# EAGLE schematic MiniPrinterController (EAGLE 9.6.2)

## Sheet 1 of 2: power board
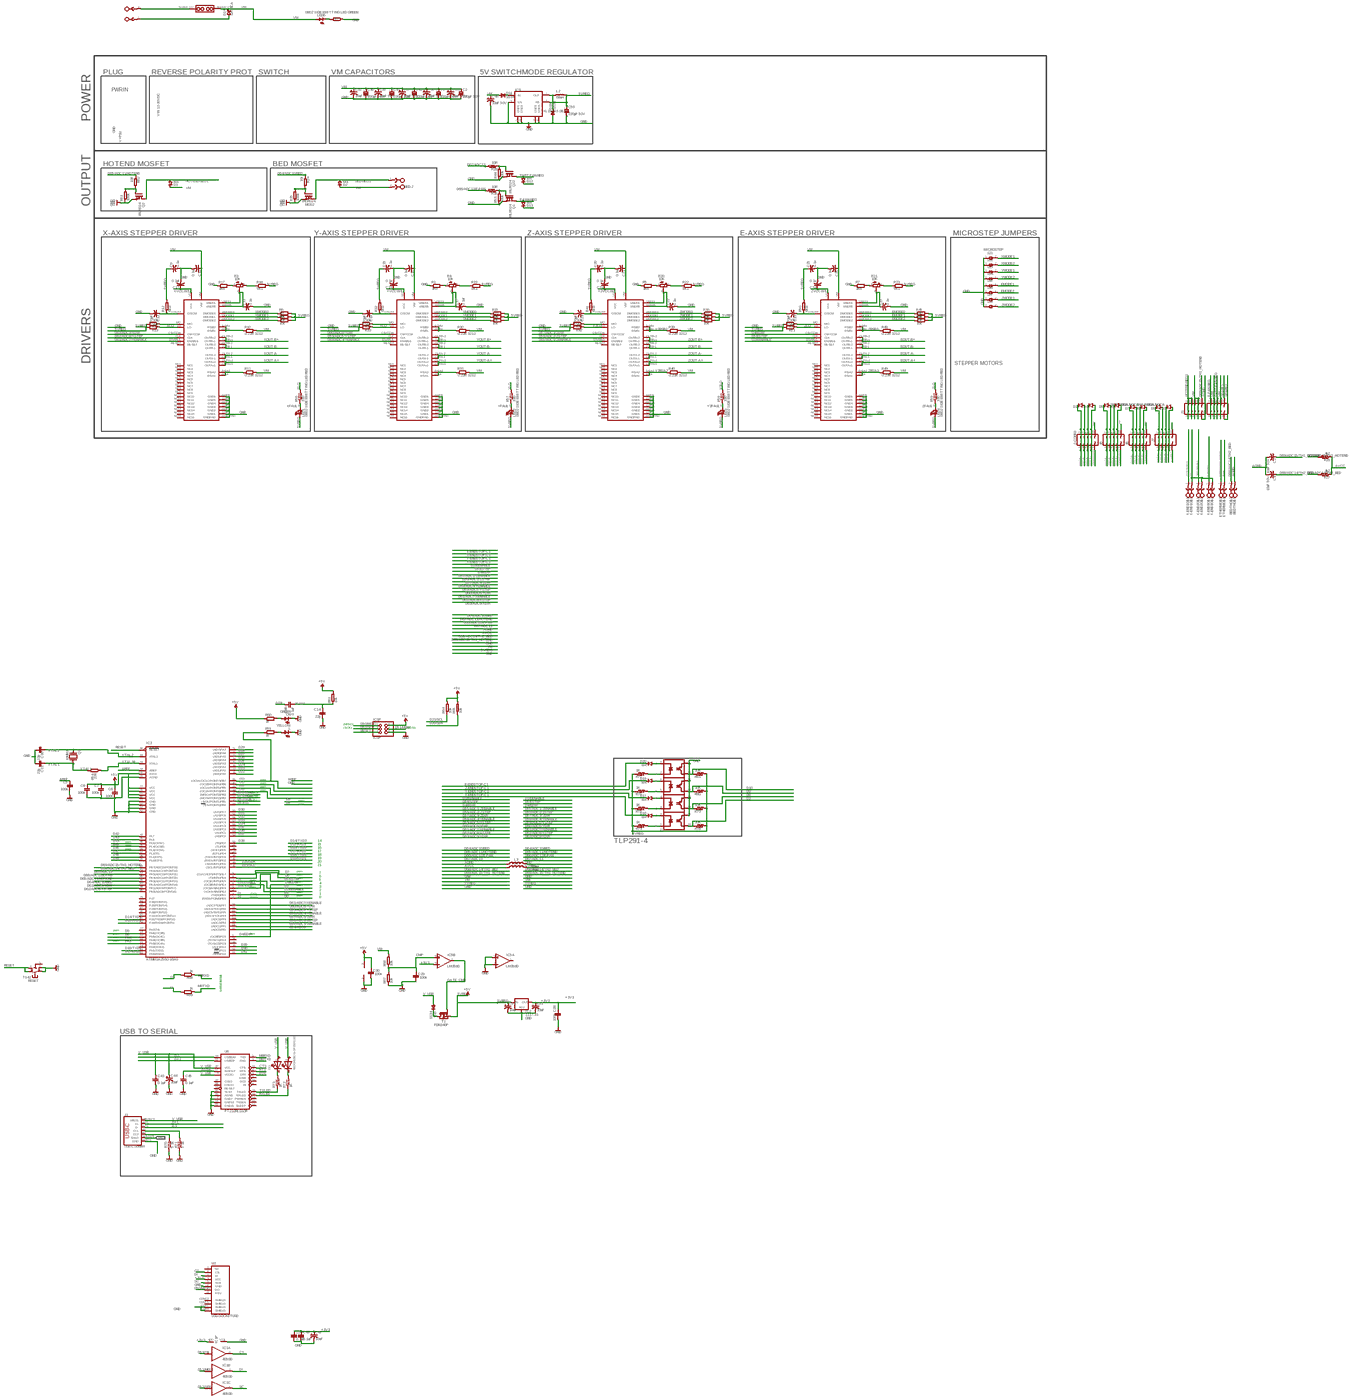
[diagram p0: schematic, sheet 1, overview]
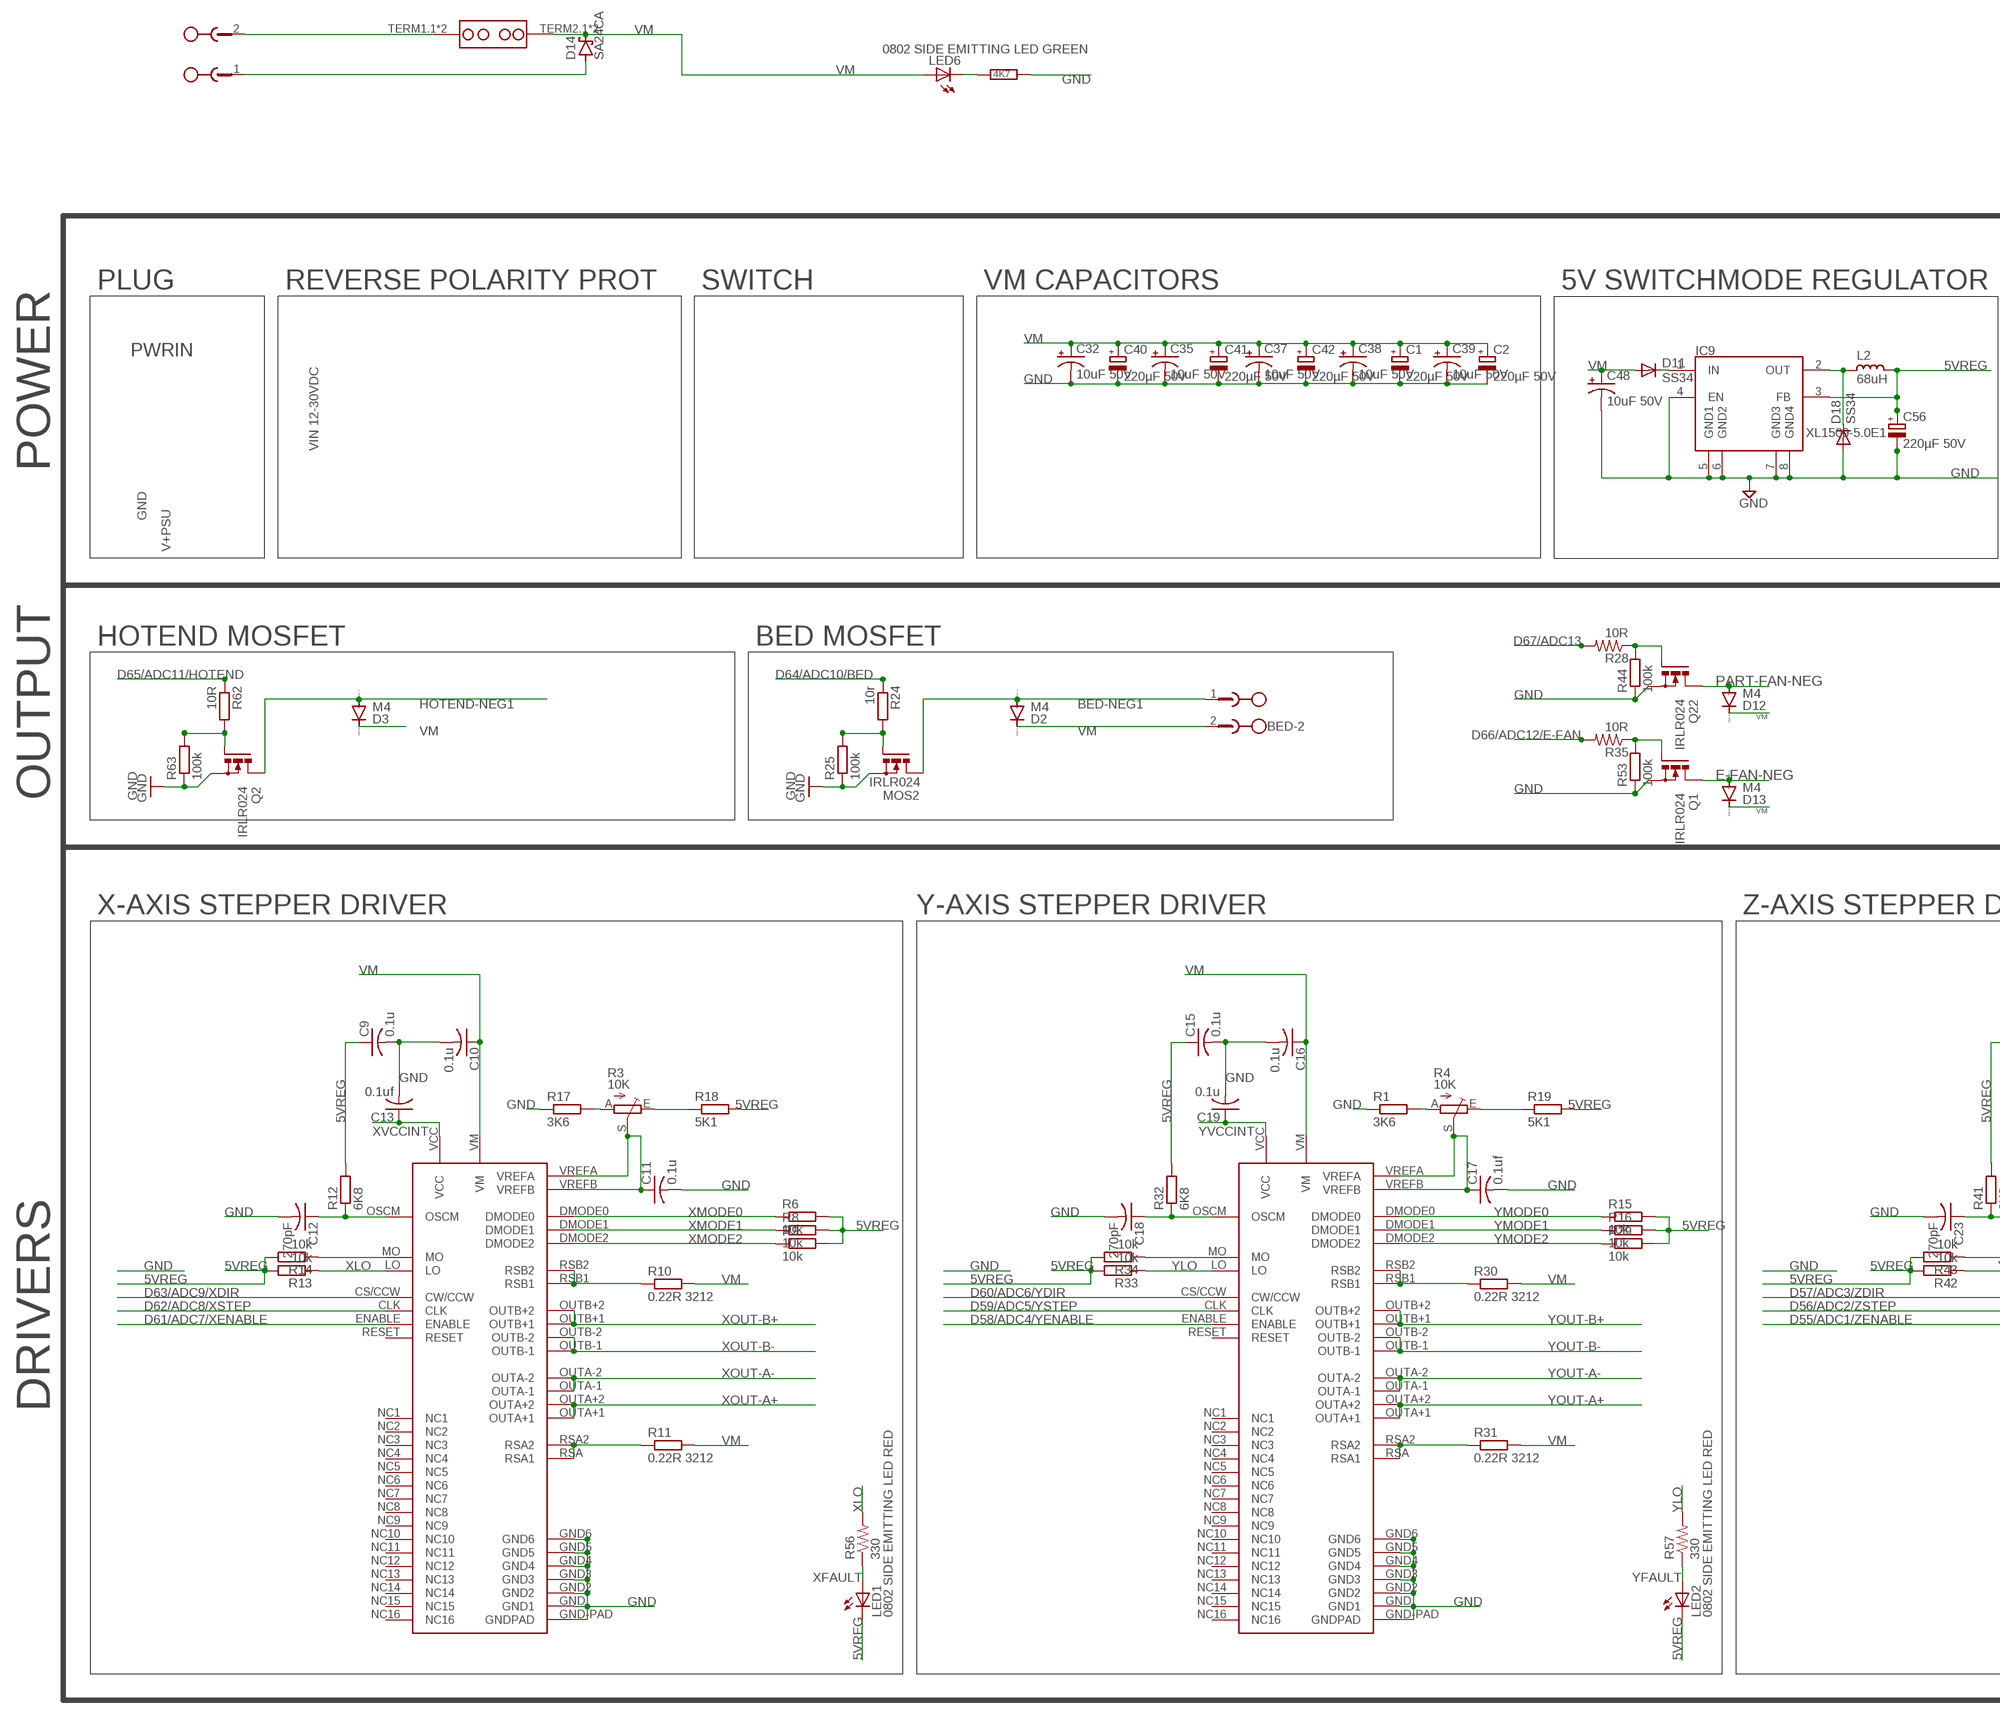
[diagram p1: schematic, sheet 1, part 1 of 7]
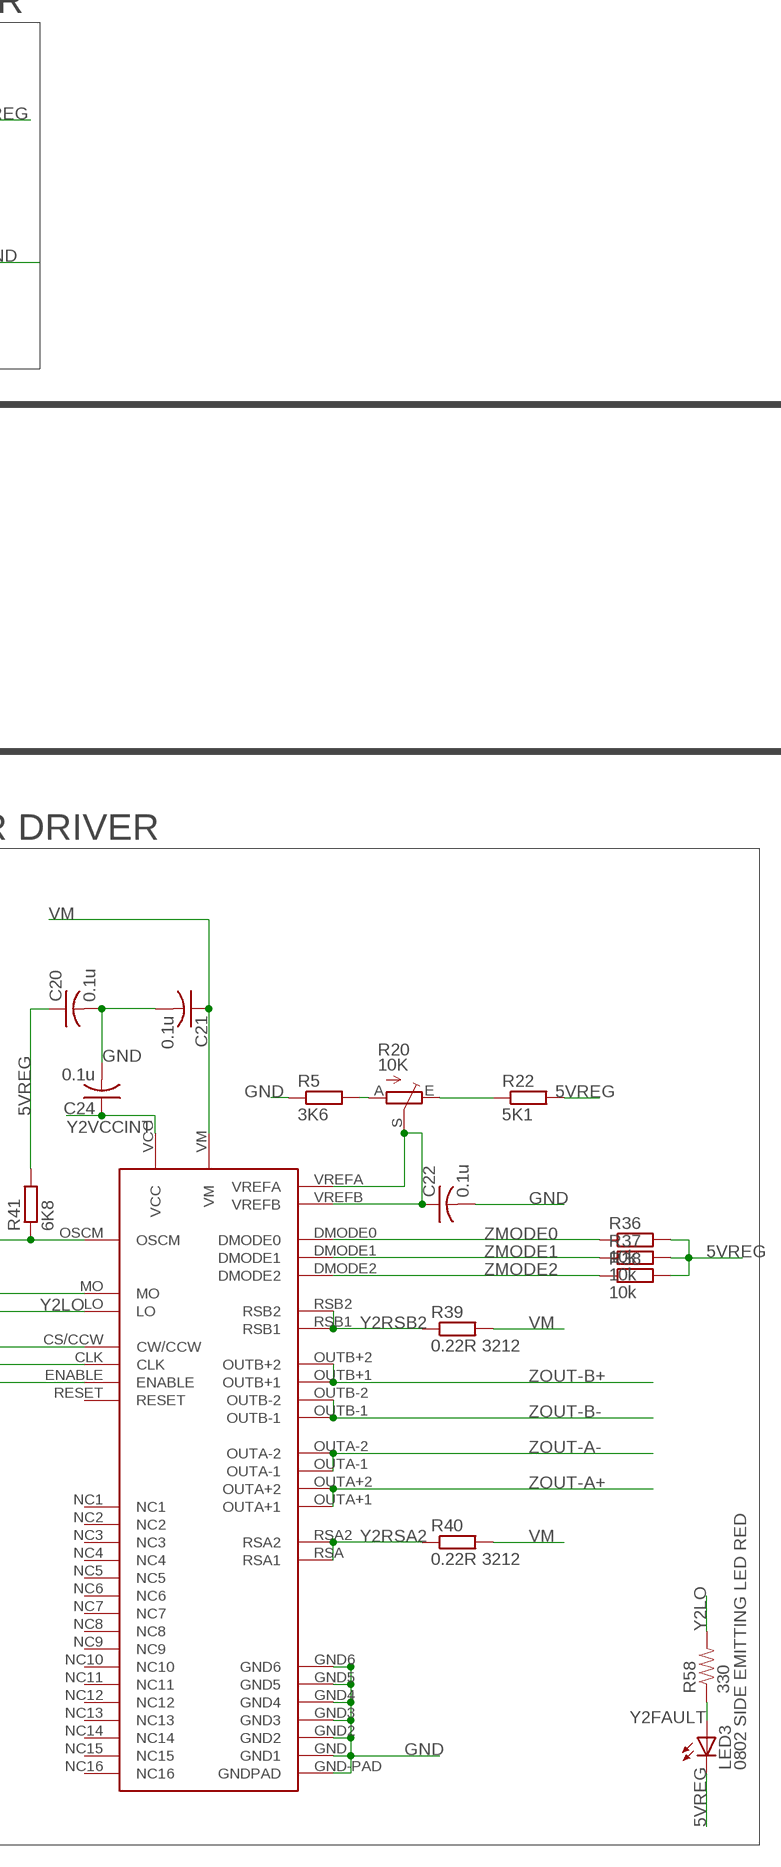
[diagram p2: schematic, sheet 1, part 2 of 7]
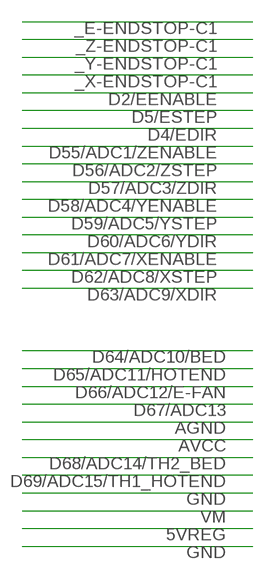
[diagram p3: schematic, sheet 1, part 3 of 7]
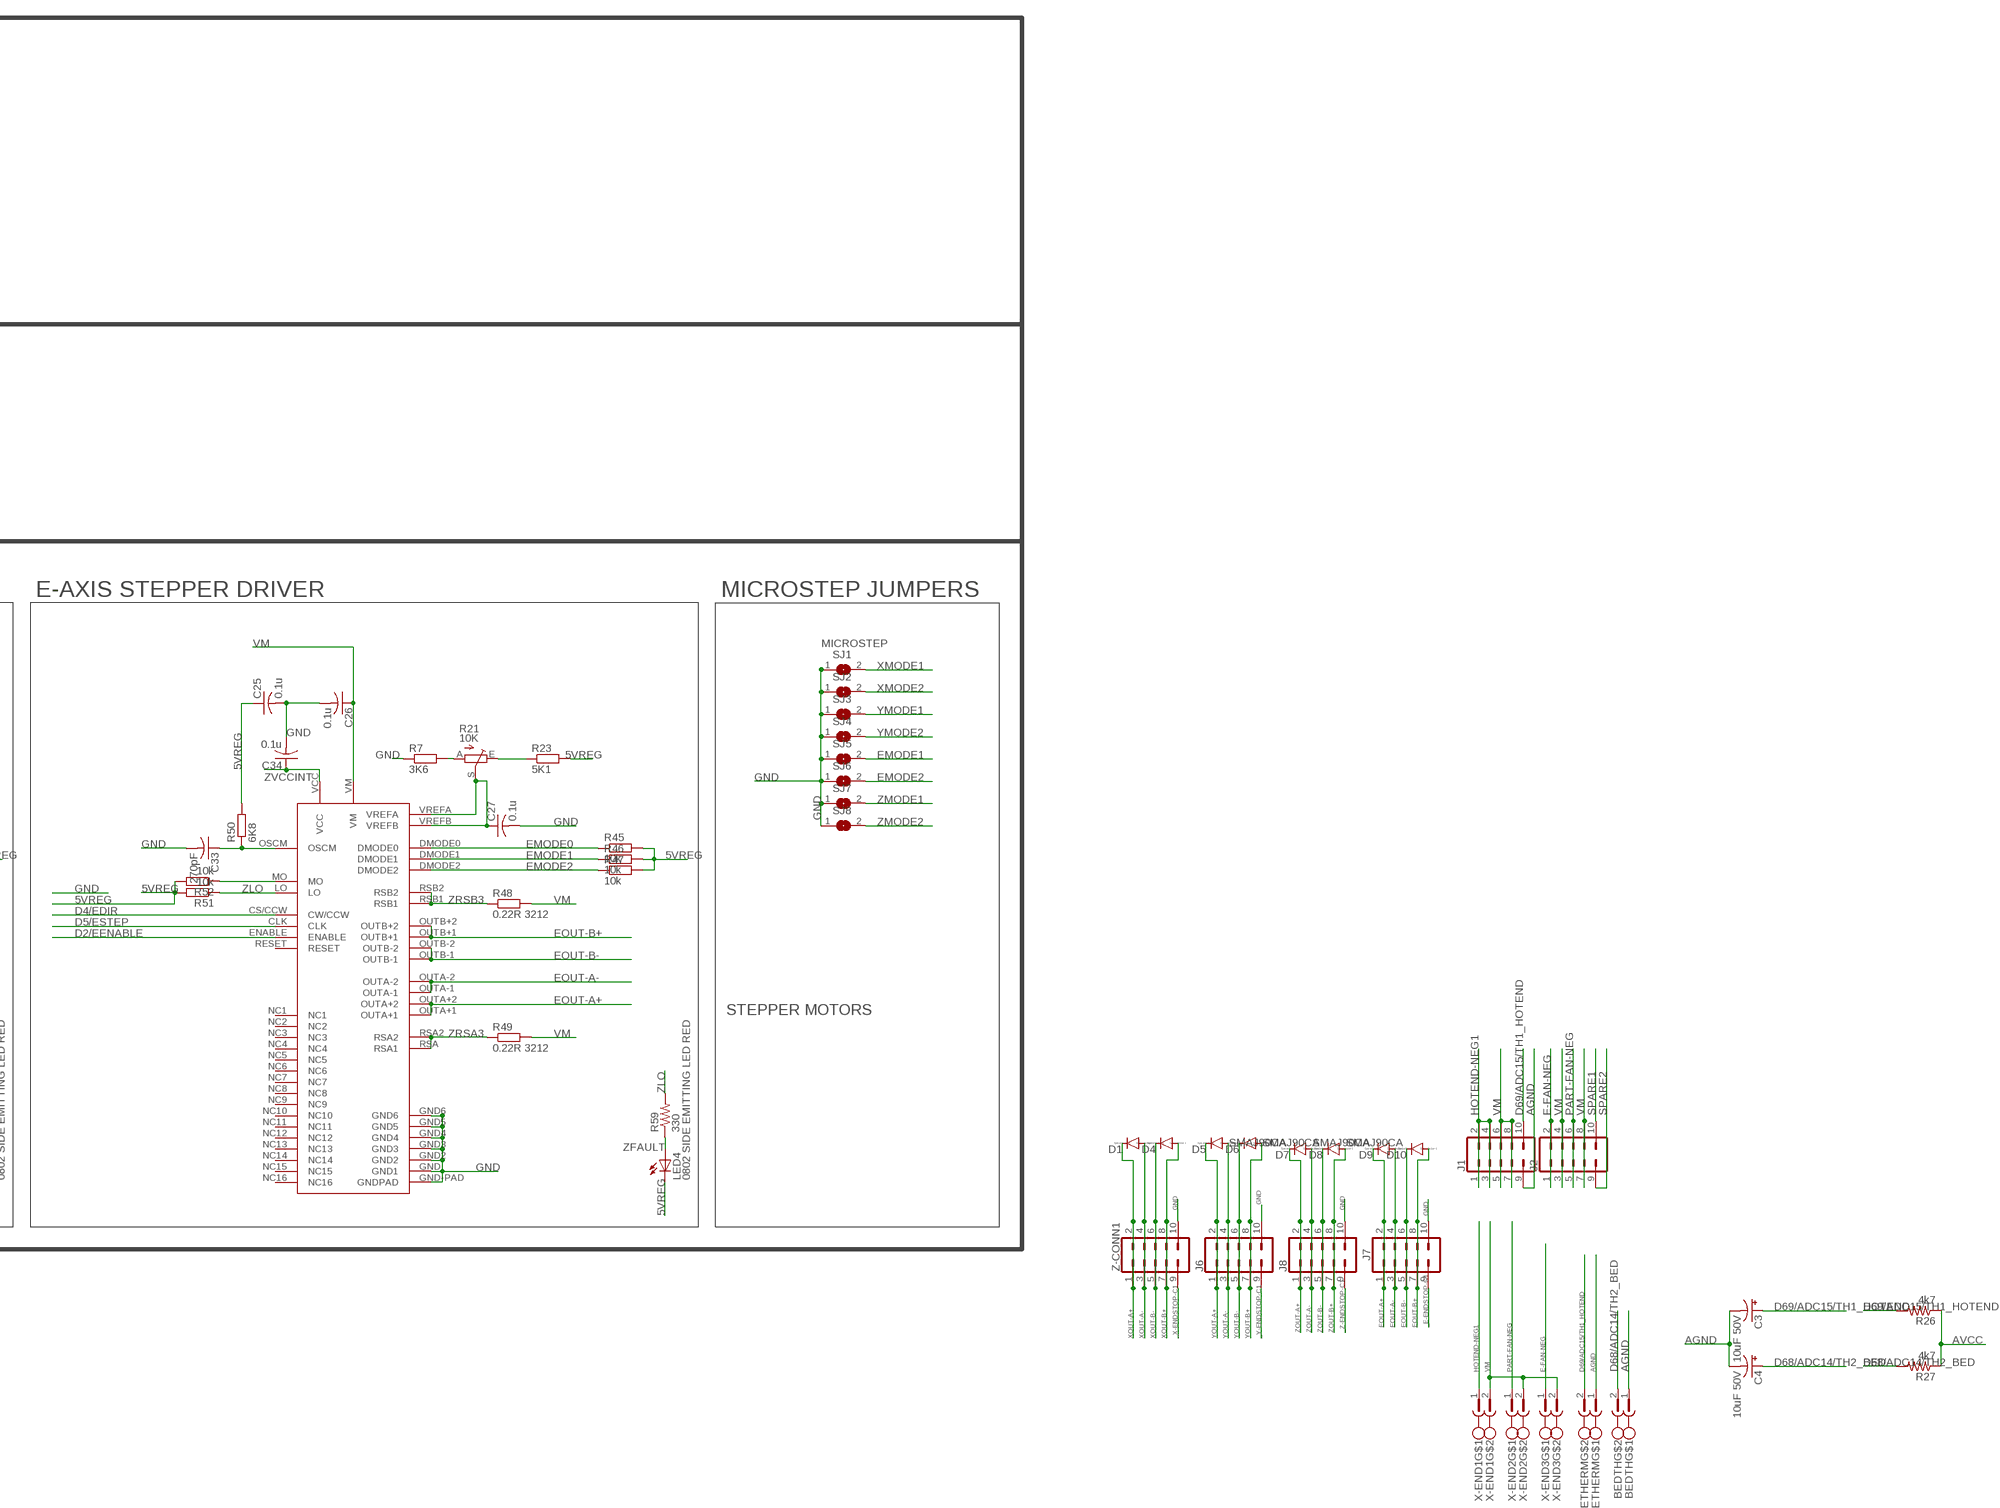
[diagram p4: schematic, sheet 1, part 4 of 7]
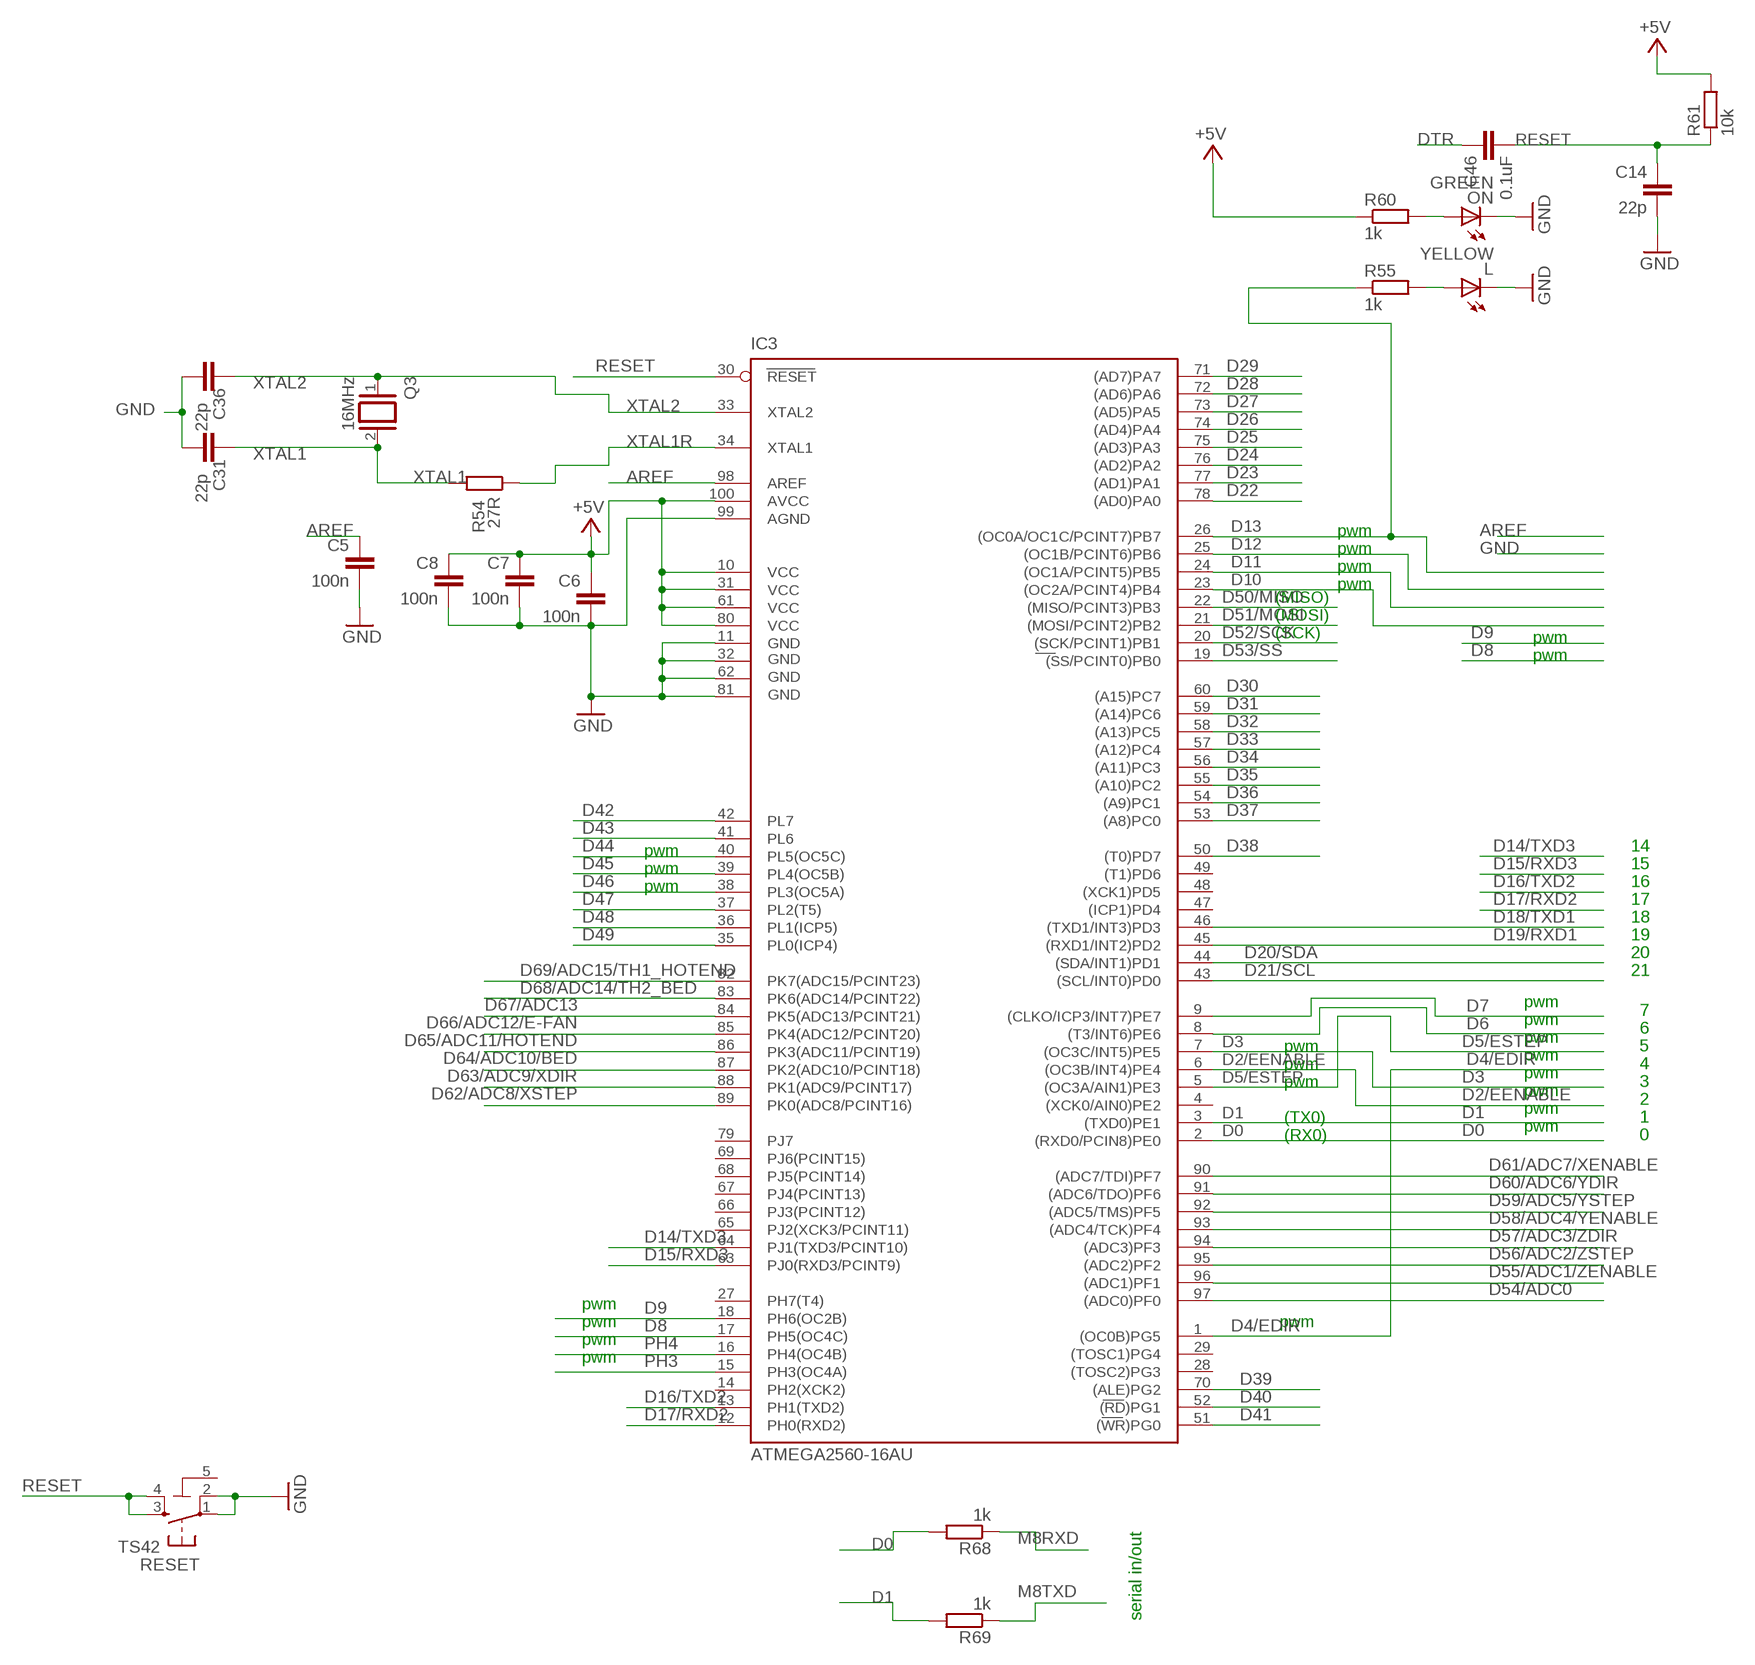
[diagram p5: schematic, sheet 1, part 5 of 7]
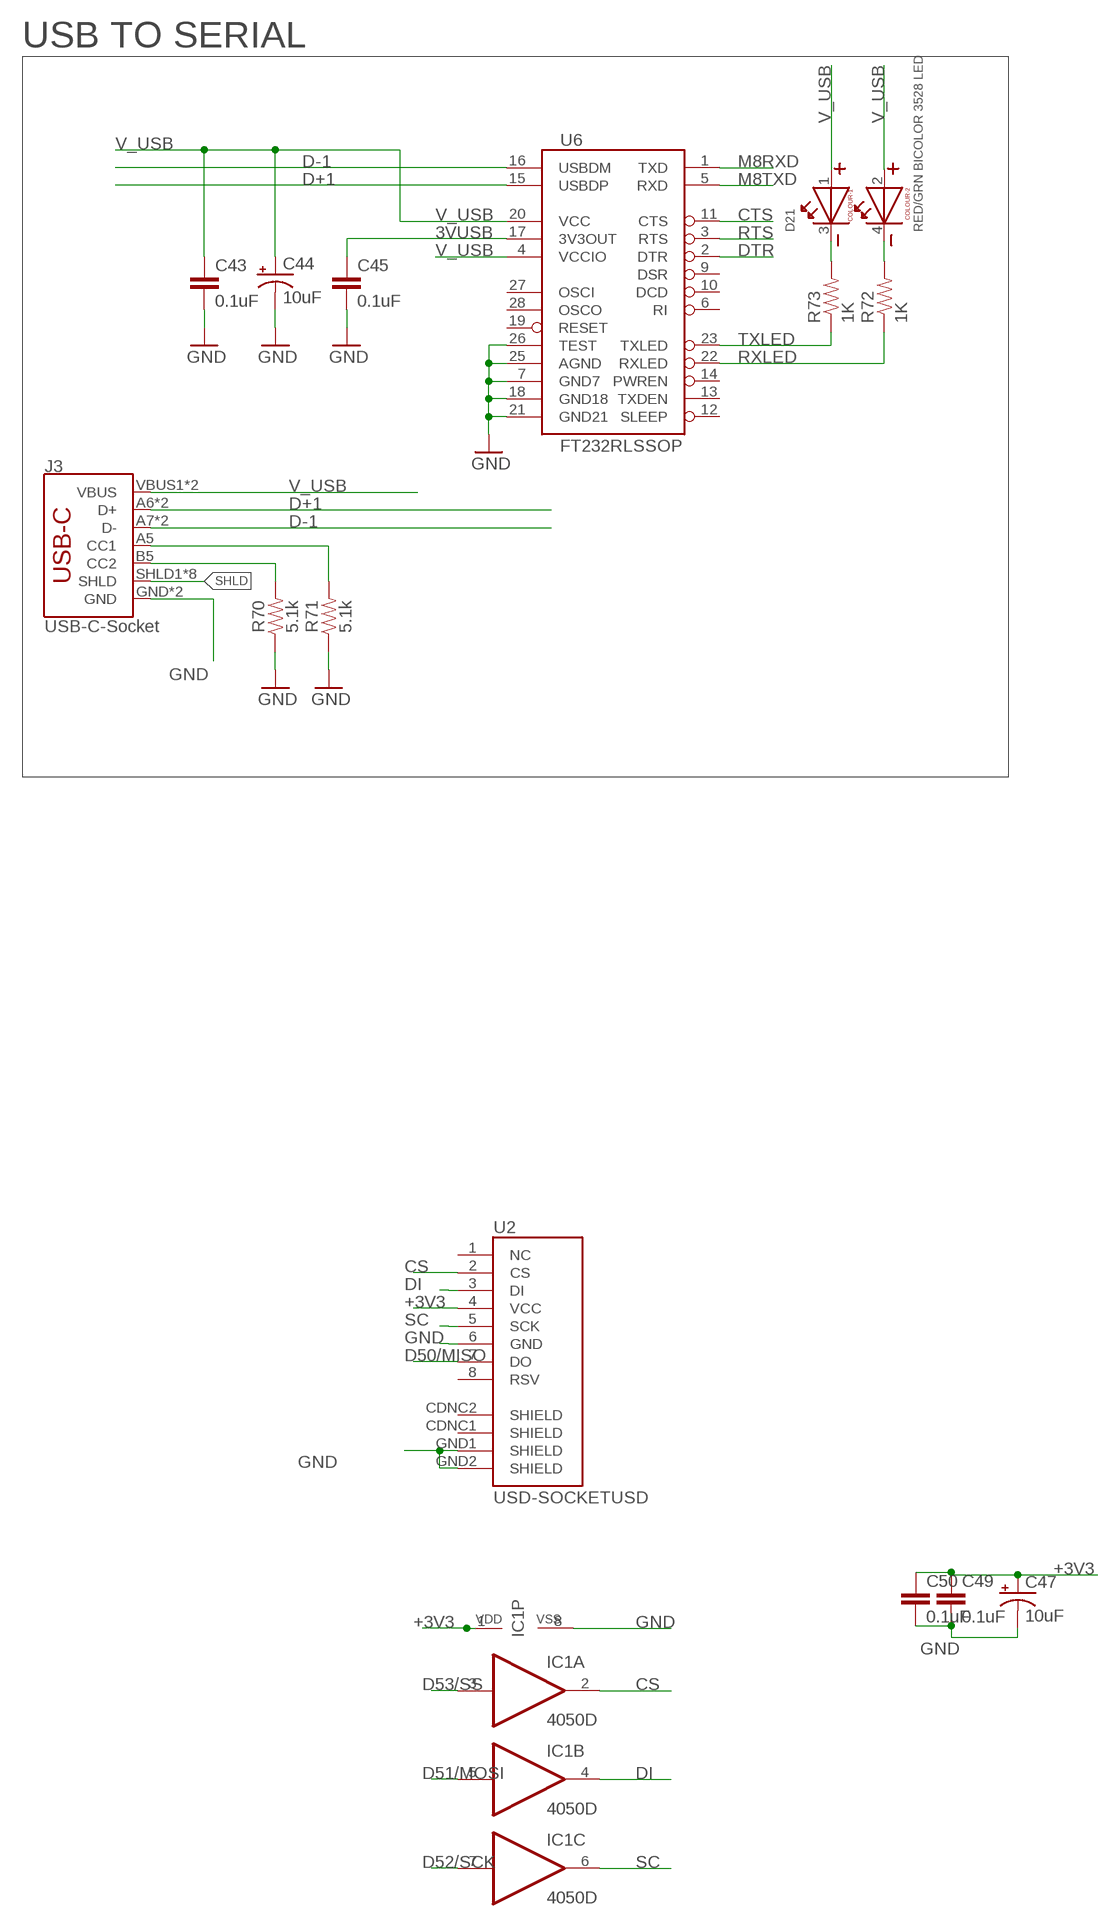
[diagram p6: schematic, sheet 1, part 6 of 7]
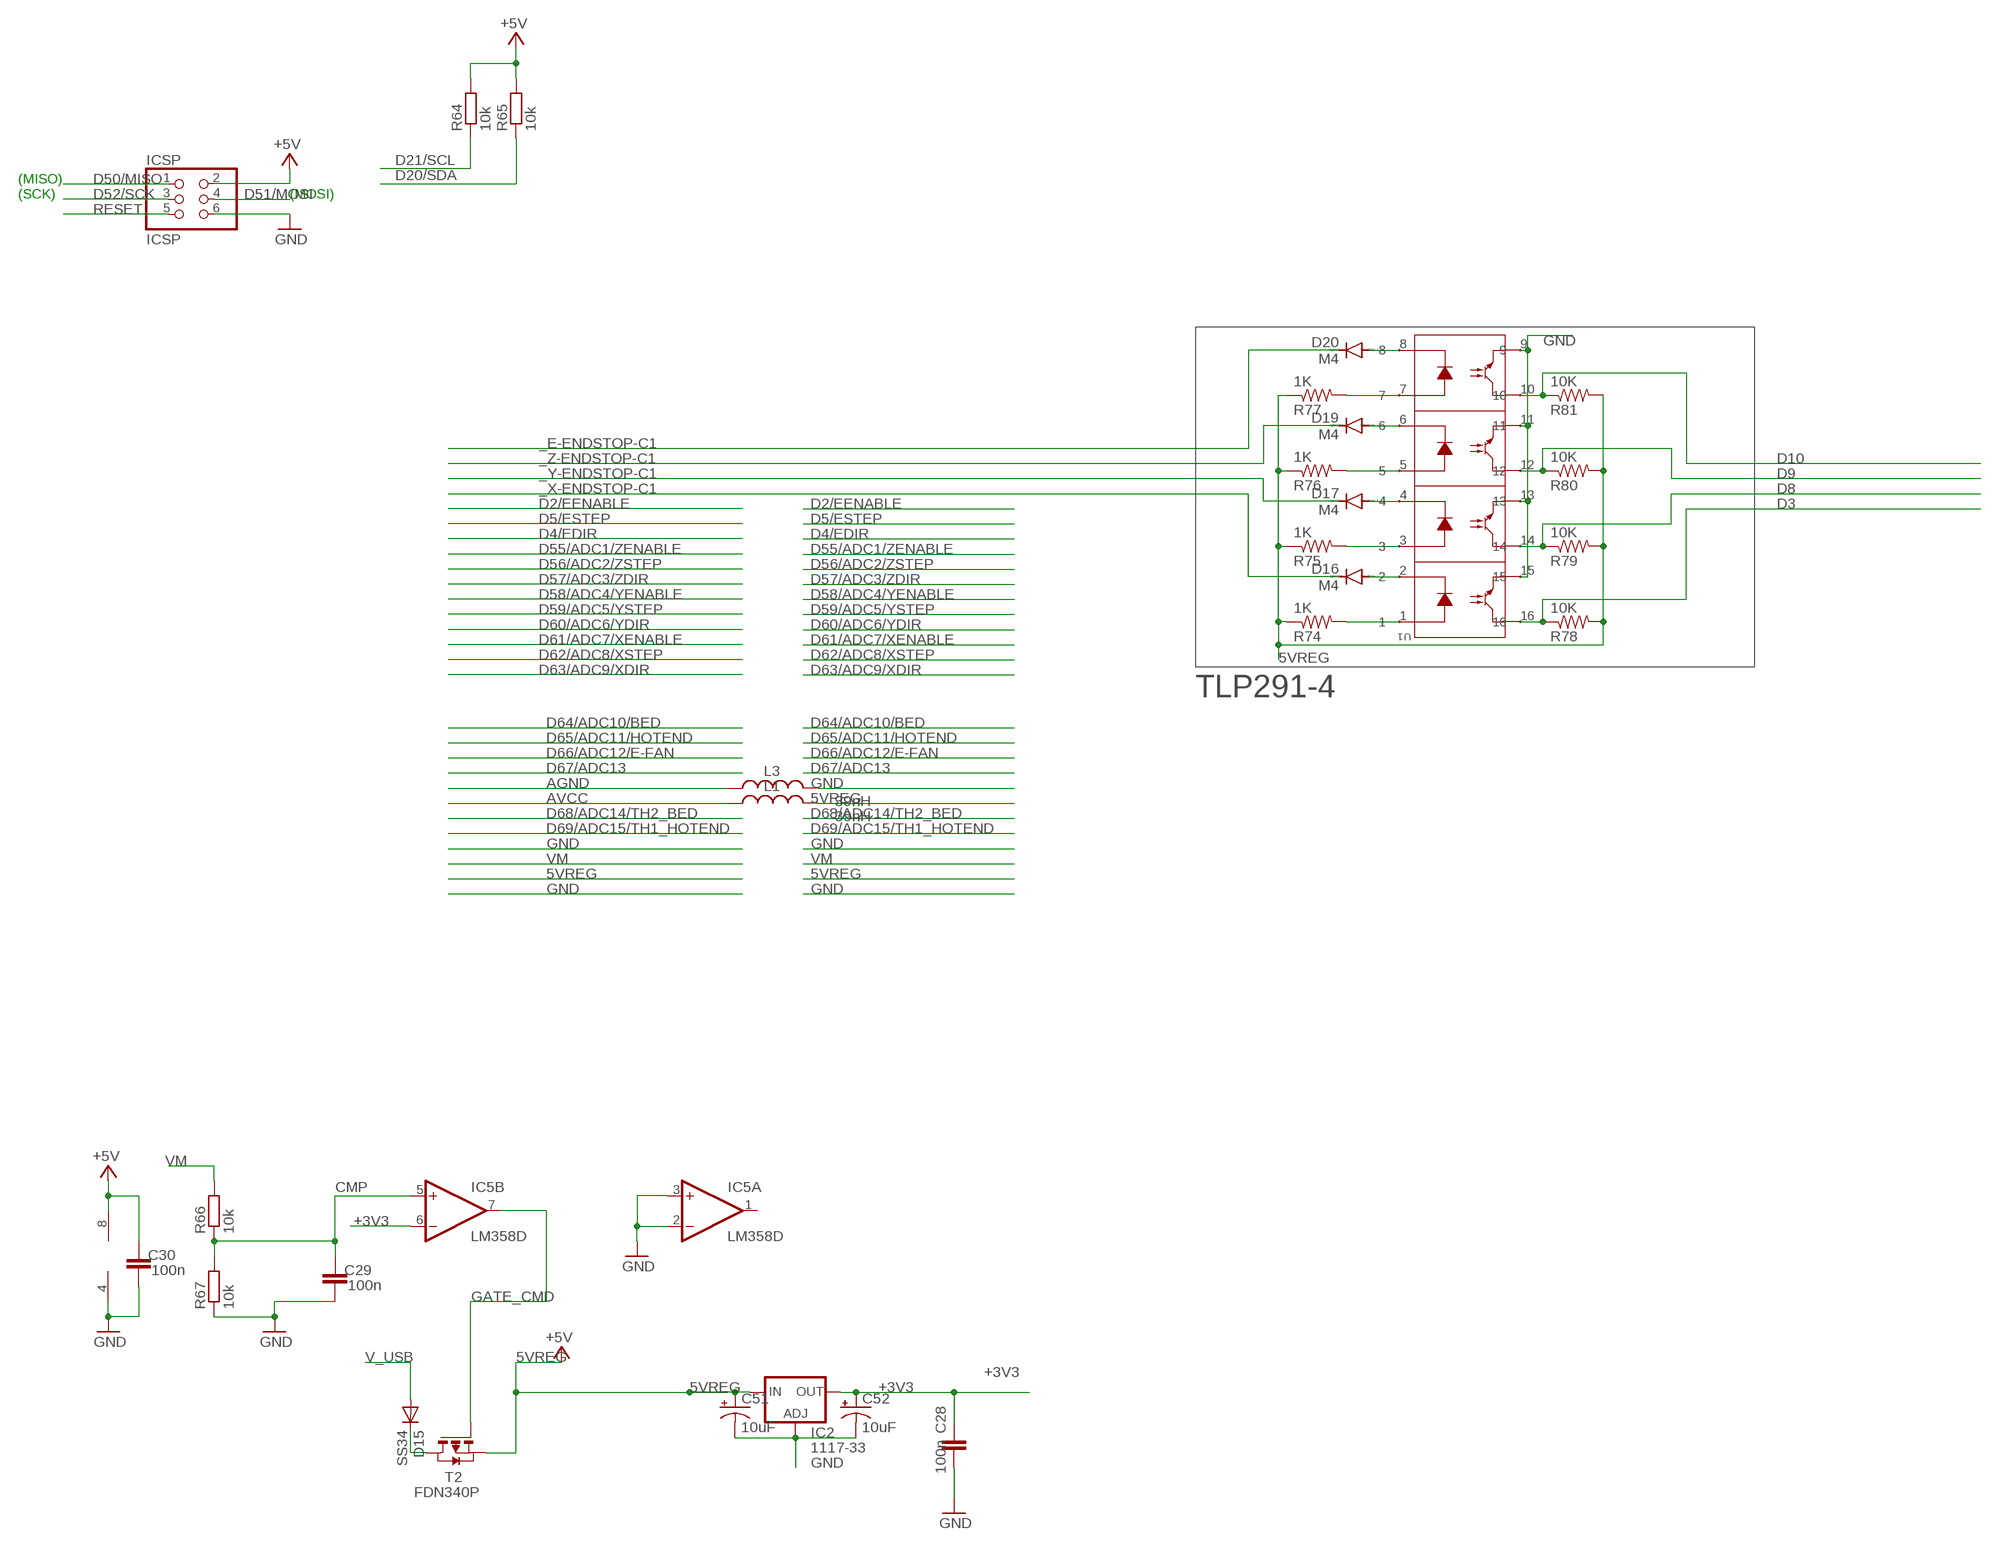
[diagram p7: schematic, sheet 1, part 7 of 7]

### Parts
BED  Phoenix Pluggable 5.08mm 2 way  MSTBA2  [MSTBA2]
BEDTH  Phoenix Pluggable 3.81mm 2 way  MC1.5/2  [MC1.5/2-G-3.81]
C1  220µF 50V  CPOL-EUE3.5-10  [E3,5-10]
C2  220µF 50V  CPOL-EUE3.5-10  [E3,5-10]
C3  10uF 50V  CAP_POL1206  [EIA3216]
C4  10uF 50V  CAP_POL1206  [EIA3216]
C5  100n  C-EU0603-RND  [C0603-ROUND]
C6  100n  C-EU0603-RND  [C0603-ROUND]
C7  100n  C-EU0603-RND  [C0603-ROUND]
C8  100n  C-EU0603-RND  [C0603-ROUND]
C9  0.1u  C-USC0603K  [C0603K]
C10  0.1u  C-USC0603K  [C0603K]
C11  0.1u  C-USC0603K  [C0603K]
C12  270pF  C-USC0603K  [C0603K]
C13  0.1uf  C-USC0603K  [C0603K]
C14  22p  C-EU0603-RND  [C0603-ROUND]
C15  0.1u  C-USC0603K  [C0603K]
C16  0.1u  C-USC0603K  [C0603K]
C17  0.1uf  C-USC0603K  [C0603K]
C18  270pF  C-USC0603K  [C0603K]
C19  0.1u  C-USC0603K  [C0603K]
C20  0.1u  C-USC0603K  [C0603K]
C21  0.1u  C-USC0603K  [C0603K]
C22  0.1u  C-USC0603K  [C0603K]
C23  270pF  C-USC0603K  [C0603K]
C24  0.1u  C-USC0603K  [C0603K]
C25  0.1u  C-USC0603K  [C0603K]
C26  0.1u  C-USC0603K  [C0603K]
C27  0.1u  C-USC0603K  [C0603K]
C28  100n  C-EU0603-RND  [C0603-ROUND]
C29  100n  C-EU0603-RND  [C0603-ROUND]
C30  100n  C-EUC0603  [C0603]
C31  22p  C-EU0603-RND  [C0603-ROUND]
C32  10uF 50V  CAP_POL1206  [EIA3216]
C33  270pF  C-USC0603K  [C0603K]
C34  0.1u  C-USC0603K  [C0603K]
C35  10uF 50V  CAP_POL1206  [EIA3216]
C36  22p  C-EU0603-RND  [C0603-ROUND]
C37  10uF 50V  CAP_POL1206  [EIA3216]
C38  10uF 50V  CAP_POL1206  [EIA3216]
C39  10uF 50V  CAP_POL1206  [EIA3216]
C40  220µF 50V  CPOL-EUE3.5-10  [E3,5-10]
C41  220µF 50V  CPOL-EUE3.5-10  [E3,5-10]
C42  220µF 50V  CPOL-EUE3.5-10  [E3,5-10]
C43  0.1uF  CAP0603-CAP  [0603-CAP]
C44  10uF  CAP_POL1206  [EIA3216]
C45  0.1uF  CAP0603-CAP  [0603-CAP]
C46  0.1uF  C-EU0603-RND  [C0603-ROUND]
C47  10uF  CAP_POL1206  [EIA3216]
C48  10uF 50V  CAP_POL1206  [EIA3216]
C49  0.1uF  CAP0603-CAP  [0603-CAP]
C50  0.1uF  CAP0603-CAP  [0603-CAP]
C51  10uF  CAP_POL1206  [EIA3216]
C52  10uF  CAP_POL1206  [EIA3216]
C56  220µF 50V  CPOL-EUE3.5-10  [E3,5-10]
D1  SMAJ90CA  DIODE-DO-214AC  [DO-214AC]
D2  M4  DIODE-DO-214AC  [DO-214AC]
D3  M4  DIODE-DO-214AC  [DO-214AC]
D4  SMAJ90CA  DIODE-DO-214AC  [DO-214AC]
D5  SMAJ90CA  DIODE-DO-214AC  [DO-214AC]
D6  SMAJ90CA  DIODE-DO-214AC  [DO-214AC]
D7  SMAJ90CA  DIODE-DO-214AC  [DO-214AC]
D8  SMAJ90CA  DIODE-DO-214AC  [DO-214AC]
D9  SMAJ90CA  DIODE-DO-214AC  [DO-214AC]
D10  SMAJ90CA  DIODE-DO-214AC  [DO-214AC]
D11  SS34  DIODE-DO-214AC  [DO-214AC]
D12  M4  DIODE-DO-214AC  [DO-214AC]
D13  M4  DIODE-DO-214AC  [DO-214AC]
D14  SA24CA  1N6267A  [C4111-15]
D15  SS34  DIODE-DO-214AC  [DO-214AC]
D16  M4  DIODE-DO-214AC  [DO-214AC]
D17  M4  DIODE-DO-214AC  [DO-214AC]
D18  SS34  DIODE-DO-214AC  [DO-214AC]
D19  M4  DIODE-DO-214AC  [DO-214AC]
D20  M4  DIODE-DO-214AC  [DO-214AC]
D21  RED/GRN BICOLOR 3528 LED  WL-SBTW-150141RB73100-R&B  [3528]
ETHERM  Phoenix Pluggable 3.81mm 2 way  MC1.5/2  [MC1.5/2-G-3.81]
IC1  4050D  [SO16]
IC2  1117-33  LD117AS33TR  [SOT223]
IC3  ATMEGA2560-16AU  ATMEGA1280-16AU  [TQFP100]
IC5  LM358D  [SO08]
IC9  XL1509-5.0E1  XL1509  [SO08]
ICSP  ICSP  PINHD-2X3  [2X03]
J1  CONN_05X2SHD_LOCK  [2X5-SHROUDED_LOCK]
J2  CONN_05X2SHD_LOCK  [2X5-SHROUDED_LOCK]
J3  USB-C-Socket  USB_C16PIN  [USB-C-16P]
J6  CONN_05X2SHD_LOCK  [2X5-SHROUDED_LOCK]
J7  CONN_05X2SHD_LOCK  [2X5-SHROUDED_LOCK]
J8  CONN_05X2SHD_LOCK  [2X5-SHROUDED_LOCK]
L  YELLOW  LEDCHIP-LED0805  [CHIP-LED0805]
L1  39nH  INDUCTOR0603  [0603]
L2  68uH  L_CD75  [CD75]
L3  39nH  INDUCTOR0603  [0603]
LED1  0802 SIDE EMITTING LED RED  LEDCHIPLED_0805  [CHIPLED_0805]
LED2  0802 SIDE EMITTING LED RED  LEDCHIPLED_0805  [CHIPLED_0805]
LED3  0802 SIDE EMITTING LED RED  LEDCHIPLED_0805  [CHIPLED_0805]
LED4  0802 SIDE EMITTING LED RED  LEDCHIPLED_0805  [CHIPLED_0805]
LED6  0802 SIDE EMITTING LED GREEN  LED3MM  [LED3MM]
MOS2  IRLR024  N-POWER-MOSFETD2PAK-MOSFET  [D2PACK]
ON  GREEN  LEDCHIP-LED0805  [CHIP-LED0805]
PWRIN  Phoenix Pluggable 5.08mm 2 way  MSTBA2  [MSTBA2]
Q1  IRLR024  N-POWER-MOSFETDPAK-MOSFET  [D-PAK_TO252AA]
Q2  IRLR024  N-POWER-MOSFETDPAK-MOSFET  [D-PAK_TO252AA]
Q3  16MHz  XTAL/S  [QS]
Q22  IRLR024  N-POWER-MOSFETDPAK-MOSFET  [D-PAK_TO252AA]
R1  3K6  R-EU_R0603  [R0603]
R2  4K7  R-EU_R0603  [R0603]
R3  10K  TRIM_EU-B25P  [B25P]
R4  10K  TRIM_EU-B25P  [B25P]
R5  3K6  R-EU_R0603  [R0603]
R6  10k  R-EU_R0603  [R0603]
R7  3K6  R-EU_R0603  [R0603]
R8  10k  R-EU_R0603  [R0603]
R9  10k  R-EU_R0603  [R0603]
R10  0.22R 3212  R-EU_R1210  [R1210]
R11  0.22R 3212  R-EU_R1210  [R1210]
R12  6K8  R-EU_R0603  [R0603]
R13  10k  R-EU_R0603  [R0603]
R14  10k  R-EU_R0603  [R0603]
R15  10k  R-EU_R0603  [R0603]
R16  10k  R-EU_R0603  [R0603]
R17  3K6  R-EU_R0603  [R0603]
R18  5K1  R-EU_R0603  [R0603]
R19  5K1  R-EU_R0603  [R0603]
R20  10K  TRIM_EU-B25P  [B25P]
R21  10K  TRIM_EU-B25P  [B25P]
R22  5K1  R-EU_R0603  [R0603]
R23  5K1  R-EU_R0603  [R0603]
R24  10r  R-EU_R0603  [R0603]
R25  100k  R-EU_R0603  [R0603]
R26  4k7  R-US_R0603  [R0603]
R27  4k7  R-US_R0603  [R0603]
R28  10R  R-US_R0603  [R0603@1]
R29  10k  R-EU_R0603  [R0603]
R30  0.22R 3212  R-EU_R1210  [R1210]
R31  0.22R 3212  R-EU_R1210  [R1210]
R32  6K8  R-EU_R0603  [R0603]
R33  10k  R-EU_R0603  [R0603]
R34  10k  R-EU_R0603  [R0603]
R35  10R  R-US_R0603  [R0603@1]
R36  10k  R-EU_R0603  [R0603]
R37  10k  R-EU_R0603  [R0603]
R38  10k  R-EU_R0603  [R0603]
R39  0.22R 3212  R-EU_R1210  [R1210]
R40  0.22R 3212  R-EU_R1210  [R1210]
R41  6K8  R-EU_R0603  [R0603]
R42  10k  R-EU_R0603  [R0603]
R43  10k  R-EU_R0603  [R0603]
R44  100k  R-EU_R0603  [R0603]
R45  10k  R-EU_R0603  [R0603]
R46  10k  R-EU_R0603  [R0603]
R47  10k  R-EU_R0603  [R0603]
R48  0.22R 3212  R-EU_R1210  [R1210]
R49  0.22R 3212  R-EU_R1210  [R1210]
R50  6K8  R-EU_R0603  [R0603]
R51  10k  R-EU_R0603  [R0603]
R52  10k  R-EU_R0603  [R0603]
R53  100k  R-EU_R0603  [R0603]
R54  27R  R-EU_R0603  [R0603-ROUND]
R55  1k  R-EU_R0603  [R0603]
R56  330  330OHM1/10W1%(0603)  [0603-RES]
R57  330  330OHM1/10W1%(0603)  [0603-RES]
R58  330  330OHM1/10W1%(0603)  [0603-RES]
R59  330  330OHM1/10W1%(0603)  [0603-RES]
R60  1k  R-EU_R0603  [R0603]
R61  10k  R-EU_R0603  [R0603]
R62  10R  R-EU_R0603  [R0603]
R63  100k  R-EU_R0603  [R0603]
R64  10k  R-EU_R0603  [R0603]
R65  10k  R-EU_R0603  [R0603]
R66  10k  R-EU_R0603  [R0603]
R67  10k  R-EU_R0603  [R0603]
R68  1k  R-EU_R0603  [R0603]
R69  1k  R-EU_R0603  [R0603]
R70  5.1k  5.1KOHM5.1KOHM-0603-1/10W-1%  [0603@1]
R71  5.1k  5.1KOHM5.1KOHM-0603-1/10W-1%  [0603@1]
R72  1K  RESISTOR0603-RES  [0603-RES]
R73  1K  RESISTOR0603-RES  [0603-RES]
R74  1K  R-US_R0603  [R0603]
R75  1K  R-US_R0603  [R0603]
R76  1K  R-US_R0603  [R0603]
R77  1K  R-US_R0603  [R0603]
R78  10K  R-US_R0603  [R0603]
R79  10K  R-US_R0603  [R0603]
R80  10K  R-US_R0603  [R0603]
R81  10K  R-US_R0603  [R0603]
RESET  TS42  [TS42]
SJ1  SJ  [SJ]
SJ2  SJ  [SJ]
SJ3  SJ  [SJ]
SJ4  SJ  [SJ]
SJ5  SJ  [SJ]
SJ6  SJ  [SJ]
SJ7  SJ  [SJ]
SJ8  SJ  [SJ]
T2  FDN340P  PMOSSOT23  [SOT-23]
U1  TLP291-4  [SO16_TOS]
U2  USD-SOCKETUSD  [USD-SOCKET-PP]
U6  FT232RLSSOP  [SSOP28DB]
U$1  TB67S109AFNG  TB67S109AFTG  [TB67S109AFTG-HTSSPO48-P-300-0.50]
U$2  TB67S109AFNG  TB67S109AFTG  [TB67S109AFTG-HTSSPO48-P-300-0.50]
U$4  ATQ-FUSE  [ATQ-FUSE]
U$7  TB67S109AFNG  TB67S109AFTG  [TB67S109AFTG-HTSSPO48-P-300-0.50]
U$17  TB67S109AFNG  TB67S109AFTG  [TB67S109AFTG-HTSSPO48-P-300-0.50]
X-END1  Phoenix Pluggable 3.81mm 2 way  MC1.5/2  [MC1.5/2-G-3.81]
X-END2  Phoenix Pluggable 3.81mm 2 way  MC1.5/2  [MC1.5/2-G-3.81]
X-END3  Phoenix Pluggable 3.81mm 2 way  MC1.5/2  [MC1.5/2-G-3.81]
Z-CONN1  CONN_05X2SHD_LOCK  [2X5-SHROUDED_LOCK]

### Nets
3VUSB: C45.1 U6.17(3V3OUT)
5VREG: C6.1 C7.1 C8.1 C9.1 C15.1 C20.1 C25.1 C30.2 C51.A(+) C56.+ IC2.3(IN) IC3.10(VCC) IC3.31(VCC1) IC3.61(VCC2) IC3.80(VCC3) IC3.100(AVCC) IC5.8(P:V+) IC9.3(FB) ICSP.2 L1.2 L2.1 LED1.C LED2.C LED3.C LED4.C R6.2 R8.2 R9.2 R12.2 R13.2 R14.2 R15.2 R16.2 R18.2 R19.2 R22.2 R23.2 R29.2 R32.2 R33.2 R34.2 R36.2 R37.2 R38.2 R41.2 R42.2 R43.2 R45.2 R46.2 R47.2 R50.2 R51.2 R52.2 R60.1 R61.2 R64.2 R65.2 R74.1 R75.1 R76.1 R77.1 R78.2 R79.2 R80.2 R81.2 T2.2(S) ; supply symbol labelled +5V
+3V3: C28.2 C47.A(+) C49.1 C50.1 C52.A(+) IC1.1(P:VDD) IC2.4(OUT) IC5.6(B:-IN) U2.4(VCC)
_E-ENDSTOP-C1: D20.C J7.9
_X-ENDSTOP-C1: D16.C Z-CONN1.9
_Y-ENDSTOP-C1: D17.C J6.9
_Z-ENDSTOP-C1: D19.C J8.9
AGND: BEDTH.1 C3.C(-) C4.C(-) ETHERM.1 J1.9 L3.1
AREF: C5.1 IC3.98(AREF)
AVCC: L1.1 R26.1 R27.1
BED-NEG1: BED.1 D2.A MOS2.2(D)
CC1: J3.A5(CC1) R71.2
CC2: J3.B5(CC2) R70.2
CMP: C29.2 IC5.5(B:+IN) R66.1 R67.2
CS: IC1.2(A:O) U2.2(CS)
CTS: U6.11(CTS)
D0: IC3.2((RXD0/PCIN8)PE0) R68.2
D1: IC3.3((TXD0)PE1) R69.2
D2/EENABLE: IC3.6((OC3B/INT4)PE4) U$7.ENABLE
D3: IC3.7((OC3C/INT5)PE5) R78.1 U1.16
D4/EDIR: IC3.1((OC0B)PG5) U$7.CS/CCW(CW/CCW)
D5/ESTEP: IC3.5((OC3A/AIN1)PE3) U$7.CLK
D6: IC3.8((T3/INT6)PE6)
D7: IC3.9((CLKO/ICP3/INT7)PE7)
D8: IC3.17(PH5(OC4C)) R79.1 U1.14
D9: IC3.18(PH6(OC2B)) R80.1 U1.12
D10: IC3.23((OC2A/PCINT4)PB4) R81.1 U1.10
D11: IC3.24((OC1A/PCINT5)PB5)
D12: IC3.25((OC1B/PCINT6)PB6)
D13: IC3.26((OC0A/OC1C/PCINT7)PB7) R55.1
D14/TXD3: IC3.64(PJ1(TXD3/PCINT10))
D15/RXD3: IC3.63(PJ0(RXD3/PCINT9))
D16/TXD2: IC3.13(PH1(TXD2))
D17/RXD2: IC3.12(PH0(RXD2))
D18/TXD1: IC3.46((TXD1/INT3)PD3)
D19/RXD1: IC3.45((RXD1/INT2)PD2)
D20/SDA: IC3.44((SDA/INT1)PD1) R65.1
D21/SCL: IC3.43((SCL/INT0)PD0) R64.1
D22: IC3.78((AD0)PA0)
D23: IC3.77((AD1)PA1)
D24: IC3.76((AD2)PA2)
D25: IC3.75((AD3)PA3)
D26: IC3.74((AD4)PA4)
D27: IC3.73((AD5)PA5)
D28: IC3.72((AD6)PA6)
D29: IC3.71((AD7)PA7)
D30: IC3.60((A15)PC7)
D31: IC3.59((A14)PC6)
D32: IC3.58((A13)PC5)
D33: IC3.57((A12)PC4)
D34: IC3.56((A11)PC3)
D35: IC3.55((A10)PC2)
D36: IC3.54((A9)PC1)
D37: IC3.53((A8)PC0)
D38: IC3.50((T0)PD7)
D39: IC3.70((ALE)PG2)
D40: IC3.52((RD)PG1)
D41: IC3.51((WR)PG0)
D42: IC3.42(PL7)
D43: IC3.41(PL6)
D44: IC3.40(PL5(OC5C))
D45: IC3.39(PL4(OC5B))
D46: IC3.38(PL3(OC5A))
D47: IC3.37(PL2(T5))
D48: IC3.36(PL1(ICP5))
D49: IC3.35(PL0(ICP4))
D50/MISO: IC3.22((MISO/PCINT3)PB3) ICSP.1 U2.7(DO)
D51/MOSI: IC1.5(B:I) IC3.21((MOSI/PCINT2)PB2) ICSP.4
D52/SCK: IC1.7(C:I) IC3.20((SCK/PCINT1)PB1) ICSP.3
D53/SS: IC1.3(A:I) IC3.19((SS/PCINT0)PB0)
D54/ADC0: IC3.97((ADC0)PF0)
D55/ADC1/ZENABLE: IC3.96((ADC1)PF1) U$2.ENABLE
D56/ADC2/ZSTEP: IC3.95((ADC2)PF2) U$2.CLK
D57/ADC3/ZDIR: IC3.94((ADC3)PF3) U$2.CS/CCW(CW/CCW)
D58/ADC4/YENABLE: IC3.93((ADC4/TCK)PF4) U$1.ENABLE
D59/ADC5/YSTEP: IC3.92((ADC5/TMS)PF5) U$1.CLK
D60/ADC6/YDIR: IC3.91((ADC6/TDO)PF6) U$1.CS/CCW(CW/CCW)
D61/ADC7/XENABLE: IC3.90((ADC7/TDI)PF7) U$17.ENABLE
D62/ADC8/XSTEP: IC3.89(PK0(ADC8/PCINT16)) U$17.CLK
D63/ADC9/XDIR: IC3.88(PK1(ADC9/PCINT17)) U$17.CS/CCW(CW/CCW)
D64/ADC10/BED: IC3.87(PK2(ADC10/PCINT18)) R24.1
D65/ADC11/HOTEND: IC3.86(PK3(ADC11/PCINT19)) R62.1
D66/ADC12/E-FAN: IC3.85(PK4(ADC12/PCINT20)) R35.2
D67/ADC13: IC3.84(PK5(ADC13/PCINT21)) R28.2
D68/ADC14/TH2_BED: BEDTH.2 C4.A(+) IC3.83(PK6(ADC14/PCINT22)) R27.2
D69/ADC15/TH1_HOTEND: C3.A(+) ETHERM.2 IC3.82(PK7(ADC15/PCINT23)) J1.10 R26.2
D+1: J3.A6(D+) J3.B6(D+) U6.15(USBDP)
D-1: J3.A7(D-) J3.B7(D-) U6.16(USBDM)
DI: IC1.4(B:O) U2.3(DI)
DTR: C46.1 U6.2(DTR)
E-FAN-NEG: D13.A J2.1 J2.2 Q1.4(D) X-END3.1
EMODE0: R45.1 U$7.DMODE0
EMODE1: R46.1 SJ5.2 U$7.DMODE1
EMODE2: R47.1 SJ6.2 U$7.DMODE2
EOUT-A+: D9.C J7.1 J7.2 U$7.OUTA+1 U$7.OUTA+2
EOUT-A-: D9.A J7.3 J7.4 U$7.OUTA-1 U$7.OUTA-2
EOUT-B+: D10.A J7.7 J7.8 U$7.OUTB+1 U$7.OUTB+2
EOUT-B-: D10.C J7.5 J7.6 U$7.OUTB-1 U$7.OUTB-2
GATE_CMD: IC5.7(B:OUT) T2.3(G)
GND: C1.- C2.- C5.2 C6.2 C7.2 C8.2 C9.2 C10.2 C11.2 C12.2 C13.2 C14.2 C15.2 C16.2 C17.2 C18.2 C19.2 C20.2 C21.2 C22.2 C23.2 C24.2 C25.2 C26.2 C27.2 C28.1 C29.1 C30.1 C31.1 C32.C(-) C33.2 C34.2 C35.C(-) C36.1 C37.C(-) C38.C(-) C39.C(-) C40.- C41.- C42.- C43.2 C44.C(-) C45.2 C47.C(-) C48.C(-) C49.2 C50.2 C51.C(-) C52.C(-) C56.- D14.A D18.2(A) IC1.8(P:VSS) IC2.1(ADJ) IC3.11(GND) IC3.32(GND1) IC3.62(GND2) IC3.81(GND3) IC3.99(AGND) IC5.2(A:-IN) IC5.3(A:+IN) IC5.4(P:V-) IC9.4(EN) IC9.5(GND1) IC9.6(GND2) IC9.7(GND3) IC9.8(GND4) ICSP.6 J3.GND J3.GND2(GND) J6.10 J7.10 J8.10 L3.2 L.C MOS2.3(S) ON.C PWRIN.1 Q1.3(S) Q2.3(S) Q22.3(S) R1.1 R2.1 R5.1 R7.1 R17.1 R25.1 R44.1 R53.1 R63.1 R67.1 R70.1 R71.1 RESET.1 RESET.2 SJ1.1 SJ2.1 SJ3.1 SJ4.1 SJ5.1 SJ6.1 SJ7.1 SJ8.1 U1.9 U1.11 U1.13 U1.15 U2.6(GND) U2.GND1(SHIELD) U2.GND2(SHIELD) U6.7(GND7) U6.18(GND18) U6.21(GND21) U6.25(AGND) U6.26(TEST) U$1.GND2 U$1.GND3 U$1.GND4 U$1.GND5 U$1.GND6 U$1.GND(GND1) U$1.GND-PAD(GNDPAD) U$2.GND2 U$2.GND3 U$2.GND4 U$2.GND5 U$2.GND6 U$2.GND(GND1) U$2.GND-PAD(GNDPAD) U$7.GND2 U$7.GND3 U$7.GND4 U$7.GND5 U$7.GND6 U$7.GND(GND1) U$7.GND-PAD(GNDPAD) U$17.GND2 U$17.GND3 U$17.GND4 U$17.GND5 U$17.GND6 U$17.GND(GND1) U$17.GND-PAD(GNDPAD) Z-CONN1.10
HOTEND-NEG1: D3.A J1.1 J1.2 J1.3 J1.4 Q2.4(D) X-END1.1
M8RXD: R68.1 U6.1(TXD)
M8TXD: R69.1 U6.5(RXD)
N$1: D18.1(C) IC9.2(OUT) L2.2
N$2: MOS2.1(G) R24.2 R25.2
N$3: Q2.1(G) R62.2 R63.2
N$4: D21.4(C2) R72.2
N$5: R1.2 R4.A
N$6: R5.2 R20.A
N$7: R7.2 R21.A
N$8: R3.A R17.2
N$9: R3.E R18.1
N$10: R4.E R19.1
N$11: R20.E R22.1
N$12: R21.E R23.1
N$13: ON.A R60.2
N$14: L.A R55.2
N$16: LED6.K(C) R2.2
N$26: D11.1(C) IC9.1(IN)
N$30: D21.3(C1) R73.2
N$31: R74.2 U1.1
N$32: R75.2 U1.3
N$33: R76.2 U1.5
N$34: R77.2 U1.7
N$37: D20.A U1.8
N$38: D19.A U1.6
N$40: D17.A U1.4
N$42: D16.A U1.2
N$81: Q22.1(G) R28.1 R44.2
N$82: Q1.1(G) R35.1 R53.2
P0W: C11.1 R3.S U$17.VREFA U$17.VREFB
P0W1: C17.1 R4.S U$1.VREFA U$1.VREFB
P0W2: C22.1 R20.S U$2.VREFA U$2.VREFB
P0W3: C27.1 R21.S U$7.VREFA U$7.VREFB
PART-FAN-NEG: D12.A J2.5 J2.6 Q22.4(D) X-END2.1
PH3: IC3.15(PH3(OC4A))
PH4: IC3.16(PH4(OC4B))
RESET: C14.1 C46.2 IC3.30(RESET) ICSP.5 R61.1 RESET.3 RESET.4
RTS: U6.3(RTS)
RXLED: R72.1 U6.22(RXLED)
SC: IC1.6(C:O) U2.5(SCK)
SHLD: J3.SHLD1(SHLD) J3.SHLD2(SHLD) J3.SHLD3(SHLD) J3.SHLD4(SHLD) J3.SHLD5(SHLD) J3.SHLD6(SHLD) J3.SHLD7(SHLD) J3.SHLD8(SHLD)
SPARE1: J2.10
SPARE2: J2.9
TXLED: R73.1 U6.23(TXLED)
V+PSU: PWRIN.2 U$4.TERM1.1 U$4.TERM1.2
V_USB: C43.1 C44.A(+) D15.2(A) D21.1(A1) D21.2(A2) J3.VBUS1(VBUS) J3.VBUS2(VBUS) U6.4(VCCIO) U6.20(VCC)
V_USB_AFTERDIODE: D15.1(C) T2.1(D)
VM: BED.2 C1.+ C2.+ C10.1 C16.1 C21.1 C26.1 C32.A(+) C35.A(+) C37.A(+) C38.A(+) C39.A(+) C40.+ C41.+ C42.+ C48.A(+) D2.C D3.C D11.2(A) D12.C D13.C D14.C J1.5 J1.6 J1.7 J1.8 J2.3 J2.4 J2.7 J2.8 LED6.A R10.2 R11.2 R30.2 R31.2 R39.2 R40.2 R48.2 R49.2 R66.2 U$1.VM U$2.VM U$4.TERM2.1 U$4.TERM2.2 U$7.VM U$17.VM X-END1.2 X-END2.2 X-END3.2
XFAULT: LED1.A R56.1
XLO: R13.1 R56.2 U$17.LO
XMO: R14.1 U$17.MO
XMO1: R34.1 U$1.MO
XMO2: R43.1 U$2.MO
XMO3: R52.1 U$7.MO
XMODE0: R6.1 U$17.DMODE0
XMODE1: R8.1 SJ1.2 U$17.DMODE1
XMODE2: R9.1 SJ2.2 U$17.DMODE2
XOSCM: C12.1 R12.1 U$17.OSCM
XOSCM1: C18.1 R32.1 U$1.OSCM
XOSCM2: C23.1 R41.1 U$2.OSCM
XOSCM3: C33.1 R50.1 U$7.OSCM
XOUT-A+: D1.C U$17.OUTA+1 U$17.OUTA+2 Z-CONN1.1 Z-CONN1.2
XOUT-A-: D1.A U$17.OUTA-1 U$17.OUTA-2 Z-CONN1.3 Z-CONN1.4
XOUT-B+: D4.A U$17.OUTB+1 U$17.OUTB+2 Z-CONN1.7 Z-CONN1.8
XOUT-B-: D4.C U$17.OUTB-1 U$17.OUTB-2 Z-CONN1.5 Z-CONN1.6
XRSA: R11.1 U$17.RSA2 U$17.RSA(RSA1)
XRSA1: R31.1 U$1.RSA2 U$1.RSA(RSA1)
XRSB: R10.1 U$17.RSB1 U$17.RSB2
XRSB1: R30.1 U$1.RSB1 U$1.RSB2
XTAL1: C31.2 Q3.2 R54.2
XTAL1R: IC3.34(XTAL1) R54.1
XTAL2: C36.2 IC3.33(XTAL2) Q3.1
XVCCINT: C13.1 U$17.VCC
Y2FAULT: LED3.A R58.1
Y2LO: R42.1 R58.2 U$2.LO
Y2RSA2: R40.1 U$2.RSA2 U$2.RSA(RSA1)
Y2RSB2: R39.1 U$2.RSB1 U$2.RSB2
Y2VCCINT: C24.1 U$2.VCC
YFAULT: LED2.A R57.1
YLO: R33.1 R57.2 U$1.LO
YMODE0: R15.1 U$1.DMODE0
YMODE1: R16.1 SJ3.2 U$1.DMODE1
YMODE2: R29.1 SJ4.2 U$1.DMODE2
YOUT-A+: D5.C J6.1 J6.2 U$1.OUTA+1 U$1.OUTA+2
YOUT-A-: D5.A J6.3 J6.4 U$1.OUTA-1 U$1.OUTA-2
YOUT-B+: D6.A J6.7 J6.8 U$1.OUTB+1 U$1.OUTB+2
YOUT-B-: D6.C J6.5 J6.6 U$1.OUTB-1 U$1.OUTB-2
YVCCINT: C19.1 U$1.VCC
ZFAULT: LED4.A R59.1
ZLO: R51.1 R59.2 U$7.LO
ZMODE0: R36.1 U$2.DMODE0
ZMODE1: R37.1 SJ7.2 U$2.DMODE1
ZMODE2: R38.1 SJ8.2 U$2.DMODE2
ZOUT-A+: D7.C J8.1 J8.2 U$2.OUTA+1 U$2.OUTA+2
ZOUT-A-: D7.A J8.3 J8.4 U$2.OUTA-1 U$2.OUTA-2
ZOUT-B+: D8.A J8.7 J8.8 U$2.OUTB+1 U$2.OUTB+2
ZOUT-B-: D8.C J8.5 J8.6 U$2.OUTB-1 U$2.OUTB-2
ZRSA3: R49.1 U$7.RSA2 U$7.RSA(RSA1)
ZRSB3: R48.1 U$7.RSB1 U$7.RSB2
ZVCCINT: C34.1 U$7.VCC
Unconnected: IC1.9(D:I) IC1.10(D:O) IC1.11(E:I) IC1.12(E:O) IC1.14(F:I) IC1.15(F:O) IC3.4((XCK0/AIN0)PE2) IC3.14(PH2(XCK2)) IC3.27(PH7(T4)) IC3.28((TOSC2)PG3) IC3.29((TOSC1)PG4) IC3.47((ICP1)PD4) IC3.48((XCK1)PD5) IC3.49((T1)PD6) IC3.65(PJ2(XCK3/PCINT11)) IC3.66(PJ3(PCINT12)) IC3.67(PJ4(PCINT13)) IC3.68(PJ5(PCINT14)) IC3.69(PJ6(PCINT15)) IC3.79(PJ7) IC5.1(A:OUT) U2.1(NC) U2.8(RSV) U2.CDNC1(SHIELD) U2.CDNC2(SHIELD) U6.6(RI) U6.9(DSR) U6.10(DCD) U6.12(SLEEP) U6.13(TXDEN) U6.14(PWREN) U6.19(RESET) U6.27(OSCI) U6.28(OSCO) U$1.NC1 U$1.NC2 U$1.NC3 U$1.NC4 U$1.NC5 U$1.NC6 U$1.NC7 U$1.NC8 U$1.NC9 U$1.NC10 U$1.NC11 U$1.NC12 U$1.NC13 U$1.NC14 U$1.NC15 U$1.NC16 U$1.RESET U$2.NC1 U$2.NC2 U$2.NC3 U$2.NC4 U$2.NC5 U$2.NC6 U$2.NC7 U$2.NC8 U$2.NC9 U$2.NC10 U$2.NC11 U$2.NC12 U$2.NC13 U$2.NC14 U$2.NC15 U$2.NC16 U$2.RESET U$7.NC1 U$7.NC2 U$7.NC3 U$7.NC4 U$7.NC5 U$7.NC6 U$7.NC7 U$7.NC8 U$7.NC9 U$7.NC10 U$7.NC11 U$7.NC12 U$7.NC13 U$7.NC14 U$7.NC15 U$7.NC16 U$7.RESET U$17.NC1 U$17.NC2 U$17.NC3 U$17.NC4 U$17.NC5 U$17.NC6 U$17.NC7 U$17.NC8 U$17.NC9 U$17.NC10 U$17.NC11 U$17.NC12 U$17.NC13 U$17.NC14 U$17.NC15 U$17.NC16 U$17.RESET

### Notes on the sheet
- PLUG | REVERSE POLARITY PROT | SWITCH | VM CAPACITORS | 5V SWITCHMODE REGULATOR
- PWRIN
- VIN 12-30VDC
- POWER
- HOTEND MOSFET | BED MOSFET
- OUTPUT
- X-AXIS STEPPER DRIVER | Y-AXIS STEPPER DRIVER | Z-AXIS STEPPER DRIVER | E-AXIS STEPPER DRIVER | MICROSTEP JUMPERS
- MICROSTEP
- DRIVERS
- STEPPER MOTORS
- (MISO)
- (SCK) | (MOSI)
- pwm
- pwm
- pwm
- pwm
- (MISO)
- (MOSI)
- (SCK) | pwm
- pwm
- TLP291-4
- pwm | 14
- pwm | 15
- pwm | 16
- 17
- 18
- 19
- 20
- 21
- pwm
- 7
- pwm
- 6
- pwm
- pwm | 5
- pwm
- pwm | 4
- pwm
- pwm | 3
- pwm
- 2
- pwm
- (TX0) | 1
- pwm
- (RX0) | 0
- pwm
- pwm | pwm
- pwm
- pwm
- serial in/out
- USB TO SERIAL

## Sheet 2 of 2

## Power pins joined to a net without a drawn wire
5-GND: RESET.5(5-GND)

## Library data of the parts
BED PWRIN = con-phoenix-508:MSTBA2: PHOENIX; MF: FARNELL; MPN: 1757242; OC_FARNELL: 3705171; OC_NEWARK: 71C4161
BEDTH ETHERM X-END1-X-END3 = jt-con-phoenix-3.81:MC1.5/2
C1 C2 C40-C42 C56 = rcl:CPOL-EU: POLARIZED CAPACITOR, European symbol; SPICEPREFIX: C
C3 C4 C32 C35 C37-C39 C44 C47 C48 C51 C52 = SparkFun:CAP_POL: Capacitor Polarized These are standard SMD and PTH capacitors. Normally 10uF, 47uF, and 100uF in electrolytic and tantalum varieties. Always verify the external diameter of the through hole cap, it varies with capacity, voltage, and manufacturer. The EIA devices should be standard.
C5-C8 C14 C28 C29 C31 C36 C46 = SmartPrj:C-EU: CAPACITOR, European symbol
C9-C13 C15-C27 C33 C34 = rcl:C-US: CAPACITOR, American symbol; SPICEPREFIX: C
C30 = rcl:C-EU: CAPACITOR, European symbol
C43 C45 C49 C50 = SparkFun:CAP: Capacitor Standard 0603 ceramic capacitor, and 0.1" leaded capacitor.
D1-D10 D12 D13 D16 D17 D19 D20 = diode:DIODE-: DIODE
D11 D15 D18 = dp_devices:DIODE: Various Diode Packages
D14 = diode:1N6267A: DIODE transient voltage suppressor
D21 = Wurth_Elektronik_Optoelectronics_rev15c:WL-SBTW: SMD bi-color TOP LED Characteristics Low energy consumption High reliability Low current requirement Fast switching No UV/IR radiation None diffused lens Black surface Compact package outline Applications Flat backlight for LCDs, switches and symbols Decorative lighting <http://katalog.we-online.de/media/images/eipal/WL-SBTW_pf2.jpg> Details see: http://katalog.we-online.de/en/led/WL-SBTW?m Updated 2015-04-10 2015 (C) Wurth Elektronik; COMPANY-URL: http://www.we-online.de; CREATED-BY: Christin Otto; CREATED-DATE: APR 2013; DATASHEET-URL: http://katalog.we-online.de/en/led/WL-SBTW?m=t&sq=sbtw&sp=&sp=http%3A%2F%2Fwww.we-online.de%2Fweb%2Fen%2Felectronic_components%2Fsearchpage_PBS.php%3Fsearch%3Dsbtw#vs_t2:2; MANUFACTURER: Würth Elektronik eiSos GmbH
IC1 = 40xx:4050: Hex non-inverting BUFFER
IC2 = v-reg:LD117A?*: Low drop fixed and adjustable positive voltage regulators 1 A Source: http://www.st.com/stonline/products/literature/ds/7194/ld1117axx.pdf
IC3 = atmel-2005:ATMEGA*: MICROCONTROLLER 64/128/256 Kbytes FLASH 4 Kbytes EEPROM 8 Kbytes SRAM 86 General Purpose I/O pins 12-channels16-bit PWM 4 x Serial USARTs 16-channels 10-bit A/D
IC5 = linear:LM358: OP AMP also LM158; LM258; LM2904 Source: http://cache.national.com/ds/LM/LM158.pdf
IC9 = Cohesion_parts:XL1509
ICSP = pinhead:PINHD-2X3: PIN HEADER
J1 J2 J6-J8 Z-CONN1 = SparkFun-Connectors:CONN_05X2: Multi connection point. Often used as Generic Header-pin footprint for 0.1 inch spaced/style header connections For AVR SPI programming port, see special device with nice symbol: "AVR_SPI_PROG_5x2.dev" You can populate with any combo of single row headers, but if you'd like an exact match, check these: 2x5 AVR ICSP Male Header <https://www.sparkfun.com/products/778> (PRT-00778) 2x5 Pin Shrouded Header <https://www.sparkfun.com/products/8506> (PRT-08506) On any of the 0.1 inch spaced packages, you can populate with these: Break Away Headers - Straight <https://www.sparkfun.com/products/116> (PRT-00116) Break Away Male Headers - Right Angle <https://www.sparkfun.com/products/553> (PRT-00553) Female Headers <https://www.sparkfun.com/products/115> (PRT-00115) Break Away Headers - Machine Pin <https://www.sparkfun.com/products/117> (PRT-00117) Break Away Female Headers - Swiss Machine Pin <https://www.sparkfun.com/products/743> (PRT-00743) Special note: the shrouded connector mates well with our 5x2 ribbon cables: 2x5 Pin IDC Ribbon Cable <https://www.sparkfun.com/products/8535> (PRT-08535); PROD_ID: CONN-08671; SF_ID: PRT-08506
J3 = SparkFun-Connectors:USB_C: USB Type C 16Pin Connector Super Speed pins not available on the 16-pin purely SMD connector so this part is best for USB 2.0 implementations. D1 and D2 are tied together enabling D+/- no matter which way the cable is plugged into the connector. The two channel configuration pins (CC1/2) are exposed. These are normally connected to ground via 5.1k resistors but can be reconfigured for high current/high power applications.; PROD_ID: CONN-14122
L ON = led:LED: LED
L1 L3 = SparkFun:INDUCTOR: Inductors Basic Inductor/Choke - 0603 and 1206. Footprints are not proven and vary greatly between part numbers.
L2 = rc-master-smd:L_: INDUCTOR
LED1-LED4 LED6 = adafruit:LED: LED
MOS2 Q1 Q2 Q22 = Cohesion_parts:N-POWER-MOSFET
Q3 = special:XTAL/S: CRYSTAL
R1 R5-R19 R22-R25 R29-R34 R36-R53 R62 R63 = resistor:R-EU_: RESISTOR, European symbol
R2 = rcl:R-EU_: RESISTOR, European symbol
R3 R4 R20 R21 = pot:TRIM_EU-: POTENTIOMETER
R26 R27 R74-R81 = resistor:R-US_: RESISTOR, American symbol
R28 R35 = rcl:R-US_: RESISTOR, American symbol
R54 = SmartPrj:R-EU_: RESISTOR, European symbol
R55 R60 R61 R64-R69 = rcl:R-EU_: RESISTOR, European symbol; SPICEPREFIX: R
R56-R59 = SparkFun-Resistors:330OHM1/10W1%(0603): RES-00818; PROD_ID: RES-00818
R70 R71 = SparkFun-Resistors:5.1KOHM; PROD_ID: RES-12083
R72 R73 = SparkFun:RESISTOR: Resistor Basic schematic elements and footprints for 0603, 1206, and PTH resistors.
RESET = st-mod v1.4:TS42: TS42 Dongnan Electronics Tact switch VDC 12V - 50mA
SJ1-SJ8 = jumper:SJ: SMD solder JUMPER
T2 = zetex:PMOSSOT23: MOS FET
U1 = Toshiba TLP291-4 Optocoupler:TLP291-4; COPYRIGHT: Copyright (C) 2018 Accelerated Designs. All rights reserved; MANUFACTURER_PART_NUMBER: TLP291-4; SOURCELIBRARY: Toshiba_2019-02-06; VENDOR: Toshiba
U2 = SparkFun-Connectors_PETERMICROSDEBAY:USD-SOCKET: microSD Socket Push-push type uSD socket. Schematic element and footprint production proven. Spark Fun Electronics SKU : PRT-00127. tDoc lines correctly indicate media card edge positions when inserting (unlocked, locked, depressed).
U6 = SparkFun:FT232RL: USB UART FT232RL 4th Generation USB UART (USB <-> Serial) Controller. Spark Fun Electronics SKU : COM-00650
U$1 U$2 U$7 U$17 = TB67S109AFTG:TB67S109AFTG
U$4 = ATQ Fuse Holder out of 4.3mm pcb terminals:ATQ-FUSE

## Net classes
0 default: width 0.203 mm, clearance 0.152 mm